# Altium schematic sheet Power.SchDoc
size A4; CompanyName: Technische Hochschule Nürnberg Georg Simon Ohm; Organization: UltraZohm; Address1: Kesslerplatz 12; Address2: 90489 Nürnberg; Address3: GERMANY; DocumentNumber: 2; SheetNumber: 2; SheetTotal: 6; Website: www.ultrazohm.com
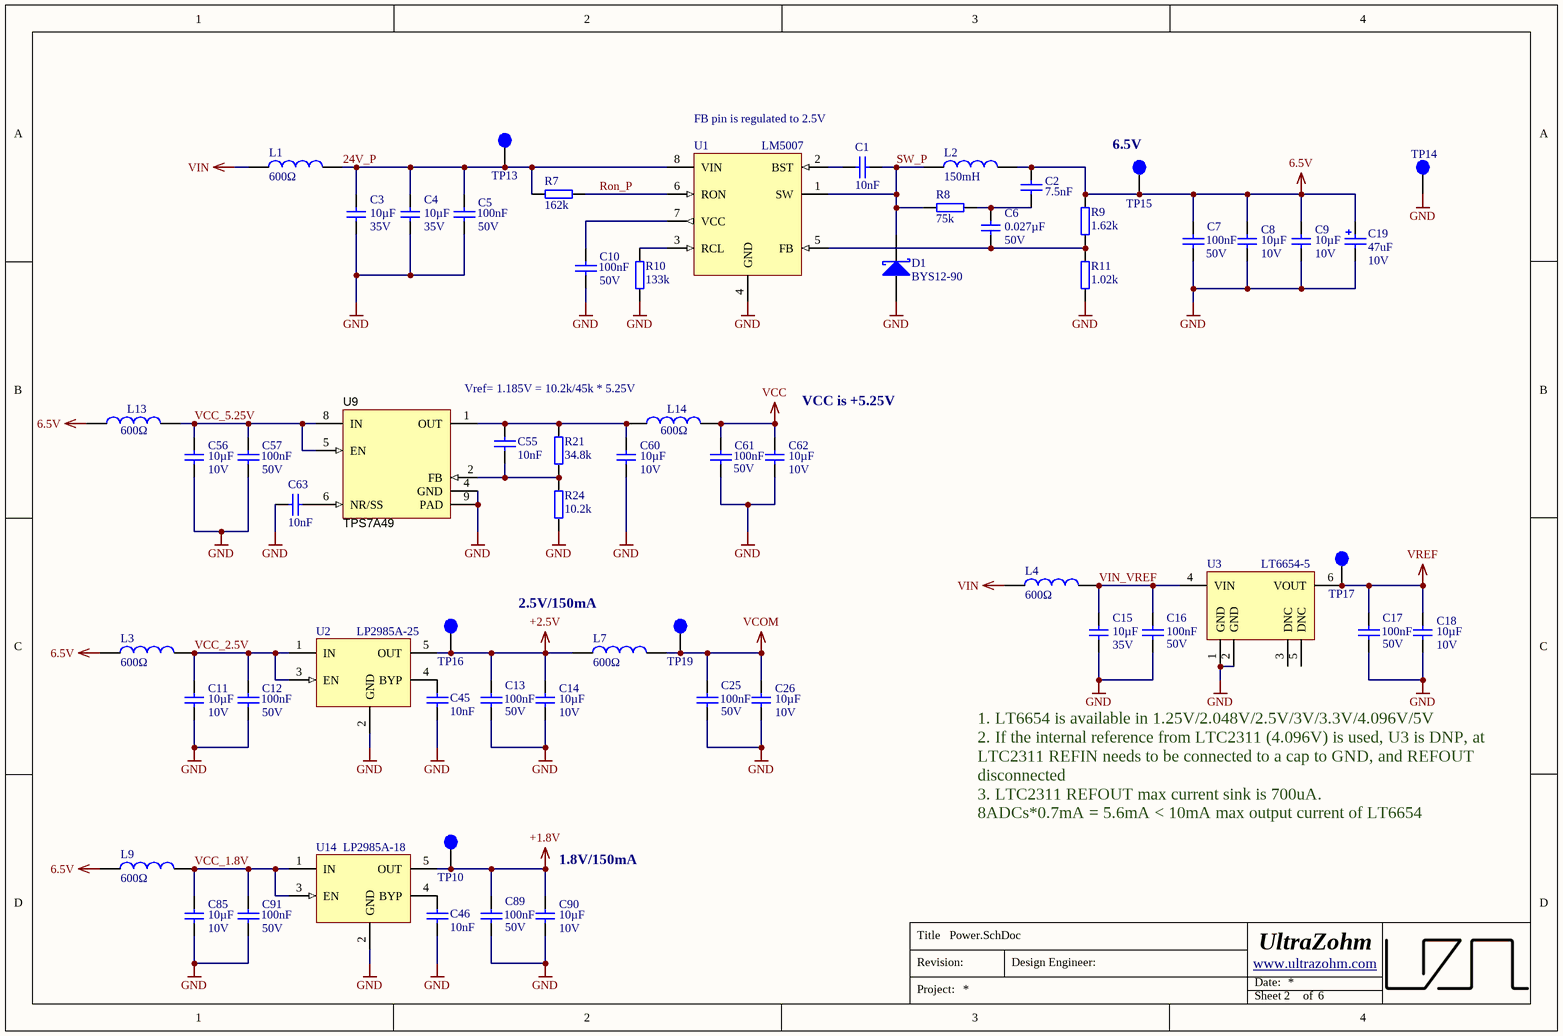
[diagram p0: Power.SchDoc]

## Parts
C1  10nF  [CAPC1608X07N]
C2  7.5nF  [CAPC1608X07N]
C3  10µF  Voltage: 35V  [C_1206]
C4  10µF  Voltage: 35V  [C_1206]
C5  100nF  Voltage: 50V  [CAPC1608X07N]
C6  0.027µF  Voltage: 50V  [C_1206]
C7  100nF  Voltage: 50V  [CAPC1608X07N]
C8  10µF  Voltage: 10V  [C_1206]
C9  10µF  Voltage: 10V  [C_1206]
C10  100nF  Voltage: 50V  [CAPC1608X07N]
C11  10µF  Voltage: 10V  [C_1206]
C12  100nF  Voltage: 50V  [CAPC1608X07N]
C13  100nF  Voltage: 50V  [CAPC1608X07N]
C14  10µF  Voltage: 10V  [C_1206]
C15  10µF  Voltage: 35V  [C_1206]
C16  100nF  Voltage: 50V  [CAPC1608X07N]
C17  100nF  Voltage: 50V  [CAPC1608X07N]
C18  10µF  Voltage: 10V  [C_1206]
C19  47uF  Voltage: 10V  [WCAP-ASLI_5x5.5]
C25  100nF  Voltage: 50V  [CAPC1608X07N]
C26  10µF  Voltage: 10V  [C_1206]
C45  10nF  [CAPC1608X07N]
C46  10nF  [CAPC1608X07N]
C55  10nF  [CAPC1608X07N]
C56  10µF  Voltage: 10V  [C_1206]
C57  100nF  Voltage: 50V  [CAPC1608X07N]
C60  10µF  Voltage: 10V  [C_1206]
C61  100nF  Voltage: 50V  [CAPC1608X07N]
C62  10µF  Voltage: 10V  [C_1206]
C63  10nF  [CAPC1608X07N]
C85  10µF  Voltage: 10V  [C_1206]
C89  100nF  Voltage: 50V  [CAPC1608X07N]
C90  10µF  Voltage: 10V  [C_1206]
C91  100nF  Voltage: 50V  [CAPC1608X07N]
D1  BYS12-90  [DIOM4227X23N]
L1  600Ω  [WE-CBF_0805_High Current]
L2  150mH  [SMT_inductor_1050_Performance]
L3  600Ω  [WE-CBF_0805_High Current]
L4  600Ω  [WE-CBF_0805_High Current]
L7  600Ω  [WE-CBF_0805_High Current]
L9  600Ω  [WE-CBF_0805_High Current]
L13  600Ω  [WE-CBF_0805_High Current]
L14  600Ω  [WE-CBF_0805_High Current]
R7  162k  [RESC1608X06N]
R8  75k  [RESC1608X06N]
R9  1.62k  [RESC1608X06N]
R10  133k  [RESC1608X06N]
R11  1.02k  [RESC1608X06N]
R21  34.8k  [RESC1608X06N]
R24  10.2k  [RESC1608X06N]
TP10  +1.8V  [TP_1mm]  (value not drawn)  (no BOM)
TP13  VIN  [TP_1mm]  (value not drawn)  (no BOM)
TP14  GND  [TP_1mm]  (value not drawn)  (no BOM)
TP15  +5V  [TP_1mm]  (value not drawn)  (no BOM)
TP16  OVCC  [TP_1mm]  (value not drawn)  (no BOM)
TP17  VREF  [TP_1mm]  (value not drawn)  (no BOM)
TP19  VCOM  [TP_1mm]  (value not drawn)  (no BOM)
U1  LM5007  [TSOP65P490X110-8N]
U2  LP2985A-25  [SOT95P250X110-5N]
U3  LT6654-5  [SOT95P280X100-6N]
U9  TPS7A49  [DGN0008D_N]
U14  LP2985A-18  [SOT95P250X110-5N]

## Nets
6.5V: C2.1 C7.2 C8.2 C9.2 C19.2(P) L2.2 L3.1 L9.1 L13.1 R9.2 TP15.1
+1.8V: C89.1 C90.2 TP10.1 U14.5(OUT)
+2.5V: C13.1 C14.2 L7.1 TP16.1 U2.5(OUT)
GND: C3.1 C4.1 C5.2 C7.1 C8.1 C9.1 C10.2 C11.1 C12.2 C13.2 C14.1 C15.1 C16.2 C17.2 C18.1 C19.1(N) C25.2 C26.1 C45.1 C46.1 C56.1 C57.2 C60.1 C61.1 C62.1 C63.2 C85.1 C89.2 C90.1 C91.2 D1.2(A) R10.1 R11.1 R24.2 TP14.1 U1.4(GND) U2.2(GND) U3.1(GND) U3.2(GND) U9.4(GND) U9.9(PAD) U14.2(GND)
VCC: C61.2 C62.2 L14.2
VCOM: C25.1 C26.2 L7.2 TP19.1
VIN: L1.1 L4.1
VREF: C17.1 C18.2 TP17.1 U3.6(VOUT)
24V_P: C3.2 C4.2 C5.1 L1.2 R7.1 TP13.1 U1.8(VIN)
Ron_P: R7.2 U1.6(RON)
SW_P: C1.2 D1.1(K) L2.1 R8.1 U1.1(SW)
VCC_1.8V: C85.2 C91.1 L9.2 U14.1(IN) U14.3(EN)
VCC_2.5V: C11.2 C12.1 L3.2 U2.1(IN) U2.3(EN)
VCC_5.25V: C56.2 C57.1 L13.2 U9.5(EN) U9.8(IN)
VIN_VREF: C15.2 C16.1 L4.2 U3.4(VIN)
NetC1_1: C1.1 U1.2(BST)
NetC2_2: C2.2 C6.2 R8.2
NetC6_1: C6.1 R9.1 R11.2 U1.5(FB)
NetC10_1: C10.1 U1.7(VCC)
NetC45_2: C45.2 U2.4(BYP)
NetC46_2: C46.2 U14.4(BYP)
NetC55_1: C55.1 C60.2 L14.1 R21.1 U9.1(OUT)
NetC55_2: C55.2 R21.2 R24.1 U9.2(FB)
NetC63_1: C63.1 U9.6(NR/SS)
NetR10_2: R10.2 U1.3(RCL)

Not connected (* = marked no-connect by the designer): U3 3(DNC) 5(DNC); U9 3(NC) 7(DNC)

## Notes on the sheet
- FB pin is regulated to 2.5V
- (near TP15) 6.5V
- Vref= 1.185V = 10.2k/45k * 5.25V
- (near C62) VCC is +5.25V
- (near L7) 2.5V/150mA
- 1. LT6654 is available in 1.25V/2.048V/2.5V/3V/3.3V/4.096V/5V
  2. If the internal reference from LTC2311 (4.096V) is used, U3 is DNP, at LTC2311 REFIN needs to be connected to a cap to GND, and REFOUT disconnected
  3. LTC2311 REFOUT max current sink is 700uA.
  8ADCs*0.7mA = 5.6mA < 10mA max output current of LT6654
- (near C90) 1.8V/150mA
- Title
- Revision:
- Design Engineer:
- Date:
- Project:
- Sheet
- of

## Library data of the parts
C1 C45 C46 = Cap_0603: MPN: 885012206065; MF: Würth; Voltage: 25V; Dielectric: X7R; Value: 10nF; Supplier 1: Mouser; Supplier 2: *; Supplier Part Number 1: 710-885012206065; Supplier Part Number 2: *; Package: 0603
C2 = Cap_0603: MPN: C0603C752J3GACTU; MF: KEMET; Voltage: 25V; Dielectric: C0G; Value: 7.5nF; Supplier 1: Mouser; Supplier 2: *; Supplier Part Number 1: 80-C0603C752J3GACTU; Supplier Part Number 2: *; Package: 0603
C3 C4 C15 = C_1206: Capacitor 1206; MPN: 1206DD106MAT2A; Tolerance: 20%; MF: AVX; Dielectric: X5R; Package: 1206; Value: 10µF; Supplier 1: Mouser; Supplier Part Number 1: 581-1206DD106MAT2A
C5 C10 C12 C57 C61 C91 = Cap_0603: MPN: CC0603KRX7R9BB104; MF: Yageo; Tolerance: 10%; Dielectric: X5R; Value: 100nF; Supplier 1: Mouser; Supplier 2: Mouser; Supplier Part Number 1: 603-CC603KRX7R9BB104; Supplier Part Number 2: 710-885382206004; Package: 0603
C6 = C_1206: Capacitor 1206; MPN: GRM3195C1H273JA01D; Tolerance: 5%; MF: Murata; Dielectric: C0G; Package: 1206; Value: 0.027µF; Created: 2018_06_25_AGeiger; Supplier 1: Mouser; Supplier Part Number 1: 81-GRM315C1H273JA01D
C7 C13 C16 C17 C25 C89 = Cap_0603: MPN: CC0603KRX7R9BB104; MF: Yageo; Dielectric: X5R; Value: 100nF; Supplier 1: Mouser; Supplier 2: Mouser; Supplier Part Number 1: 603-CC603KRX7R9BB104; Supplier Part Number 2: 710-885382206004; Package: 0603
C8 C9 C11 C14 C18 C26 C56 C60 C62 C85 C90 = C_1206: Capacitor 1206; MPN: CL31A106KPHNNNE; Tolerance: 10%; MF: Samsung Electro-Mechanics; Dielectric: X5R; Package: 1206; Value: 10µF; Created: 2020_09_17_Liegmann; Supplier 1: Mouser; Supplier Part Number 1: 187-CL31A106KPHNNNE
C19 = 865080142007: WCAP-ASLI Aluminum Electrolytic Capacitor, V-Chip, SMT, D5xH5.5mm, 47uF, 10V; MPN: 865080242004; Dissipation Factor: 24%; Endurance: 2000h; Leakage Current: 6.3uA; MF: Wurth Elektronik; Ripple Current: 170mA; Capacitance Tolerance: +/-20%; Technical Reference: ASEC055101M6R3DVCTBB000; ComponentLink1Description: Manufacturer; ComponentLink1URL: http://www.we-online.de; ComponentLink2Description: Datasheet; ComponentLink2URL: https://www.we-online.com/catalog/datasheet/865080142007.pdf; Height: 5.5mm; Mounting Technology: SMT; Operating Temperature: -55 to +105degC; Packaging: Tape and Reel; Published Date: May 2020; Diameter: 5mm; Supplier 1: Mouser; Supplier Part Number 1: 710-865080242004; Value: 47uF
C55 C63 = Cap_0603: MPN: 885012206065; MF: Würth Elektronik; Voltage: 25V; Dielectric: X7R; Value: 10nF; Supplier 1: Mouser; Supplier 2: Digi-Key; Supplier Part Number 1: 710-885012206065; Supplier Part Number 2: 732-7983-1-ND; Package: 0603
D1 = BYS12-90: Schottky Diode; MPN: BYS12-90-E3/TR3; MF: Vishay; Forward Voltage: 750mV; Reverse Voltage: 90V; Rated Current: 1.5A; Package: DO-214AC; Supplier 1: Farnell; Supplier 2: Mouser; Supplier 3: Digi-Key; Supplier Part Number 1: 2889144; Supplier Part Number 2: 625-BYS12-90-E3/TR3; Supplier Part Number 3: BYS12-90-E3/GICT-ND; ComponentLink1Description: Manufacturer; ComponentLink1URL: https://www.vishay.com/; ComponentLink2Description: Datasheet; ComponentLink2URL: https://www.vishay.com/docs/88950/bys12-90.pdf
L1 L3 L4 L7 L9 = WE-CBF, 742792040: WE-CBF SMD EMI Suppression Ferrite Bead, 0805, 600Ω; MF: Wurth Elektronik; Type: High Current; PublishedDate: Aug 2016; ComponentLink1Description: Manufacturer; ComponentLink1URL: http://www.we-online.de; ComponentLink2Description: Datasheet; ComponentLink2URL: http://katalog.we-online.de/pbs/datasheet/742792040.pdf; MPN: 742792040; Value: 600Ω; Size: 0805; Supplier 1: Farnell; Supplier 2: Mouser; Supplier 3: Digi-Key; Supplier Part Number 1: 2761567; Supplier Part Number 2: 710-742792040; Supplier Part Number 3: 732-1620-1-ND
L2 = B82464G4154M: SMT power Inductor, 150uH, 320m DRC; MF: EPCOS / TDK; Rated Current: 0.85 A; MPN: B82464G4154M; Supplier 1: Mouser; Supplier Part Number 1: 871-B82464G4154M; Value: 150mH; DCR: 320m; ComponentLink1Description: Manufacturer; ComponentLink1URL: https://www.tdk-electronics.tdk.com/de; ComponentLink2Description: Datasheet; ComponentLink2URL: https://www.tdk-electronics.tdk.com/inf/30/db/ind_2008/b82464g4.pdf
L13 L14 = WE-CBF, 742792040: WE-CBF SMD EMI Suppression Ferrite Bead, 0805, 600Ω; MF: Würth Elektronik; Type: High Current; ComponentLink1Description: Manufacturer; ComponentLink1URL: http://www.we-online.de; ComponentLink2Description: Datasheet; ComponentLink2URL: http://katalog.we-online.de/pbs/datasheet/742792040.pdf; MPN: 742792040; Value: 600Ω; Size: 0805; Supplier 1: Farnell; Supplier 2: Mouser; Supplier 3: Digi-Key; Supplier Part Number 1: 1635735; Supplier Part Number 2: 710-742792040; Supplier Part Number 3: 732-1620-1-ND
R7 = R_0603: MPN: CR0603-FX-1623ELF; MF: Bourns; Value: 162k; Supplier 1: Mouser; Supplier Part Number 1: 652-CR0603-FX1623ELF; Package: 0603
R8 = R_0603: MPN: AC0603FR-1375KL; MF: Yageo; Value: 75k; Supplier 1: Mouser; Supplier Part Number 1: 603-AC0603FR-1375KL; Package: 0603
R9 = R_0603: MPN: CR0603-FX-1621ELF; MF: Bourns; Tolerance: 1%; Value: 1.62k; Supplier 1: Mouser; Supplier Part Number 1: 652-CR0603FX-1621ELF; Package: 0603
R10 = R_0603: MPN: CR0603-FX-1333ELF; MF: Bourns; Value: 133k; Supplier 1: Mouser; Supplier Part Number 1: 652-CR0603FX-1333ELF; Package: 0603
R11 = R_0603: MPN: CR0603-FX-1021ELF; MF: Bourns; Tolerance: 1%; Value: 1.02k; Supplier 1: Mouser; Supplier Part Number 1: 652-CR0603FX-1021ELF; Package: 0603
R21 = R_0603: MPN: CR0603-FX-3482ELF; MF: Bourns; Tolerance: 1%; Value: 34.8k; Supplier 1: Mouser; Supplier Part Number 1: 652-CR0603FX-3482ELF; Package: 0603
R24 = R_0603: MPN: CR0603-FX-1022ELF; MF: Bourns; Tolerance: 1%; Value: 10.2k; Supplier 1: Mouser; Supplier Part Number 1: 652-CR0603FX-1022ELF; Package: 0603
TP10 TP13-TP17 TP19 = TP_1mm: Testpoint 1mm; Created: 2018_06_25_AGeiger; Value: Testpoint 1mm
U1 = LM5007: Buck Converter, 9-75Vin, 2.5-73Vout; MPN: LM5007MM/NOPB; MF: Texas Instruments; Supplier 1: Farnell; Supplier 2: Mouser; Supplier 3: Digi-Key; Supplier Part Number 1: 9779345; Supplier Part Number 2: 926-LM5007MM/NOPB; Supplier Part Number 3: LM5007MM/NOPBCT-ND; Package: VSSOP-8; ComponentLink1Description: Manufacturer; ComponentLink1URL: https://www.ti.com/; ComponentLink2Description: Datasheet; ComponentLink2URL: https://www.ti.com/lit/ds/symlink/lm5007.pdf?ts=1616234834930&ref_url=https%253A%252F%252Fwww.google.ru%252F
U2 = LP2985A-25: 150mA, LDO, Vout = 2.5V, Vin,max = 16V; MF: Texas Instruments; MPN: LP2985A-25; Supplier 1: Mouser; Supplier Part Number 1: 595-LP2985A-25DBVR; Package: SOT-23-5; ComponentLink1Description: Manufacturer; ComponentLink1URL: https://www.ti.com/; ComponentLink2Description: Datasheet; ComponentLink2URL: https://www.ti.com/lit/ds/symlink/lp2985a.pdf
U3 = LT6654: MPN: LT6654AIS6-5#TRMPBF; MF: Analog Devices; Package: TSOT-23-6; Supplier 1: Farnell; Supplier 2: Mouser; Supplier 3: Digi-Key; Supplier Part Number 1: 2761960; Supplier Part Number 2: 584-6654AIS65TRMPBF; Supplier Part Number 3: LT6654AIS6-5#TRMPBFCT-ND; ComponentLink1Description: Manufacturer; ComponentLink1URL: https://www.analog.com/en/index.html; ComponentLink2Description: Datasheet; ComponentLink2URL: https://www.analog.com/media/en/technical-documentation/data-sheets/6654fh.pdf
U9 = TPS7A4901DGN: +36V, +150mA, Ultralow-Noise, Positive LINEAR REGULATOR, DGN0008D; CompType: IC; MF: Texas Instruments; MPN: TPS7A4901DGN; PackageReference: DGN0008D; MountType: SMT; ComponentLink1Description: Datasheet Link; ComponentLink1URL: http://www.ti.com/lit/ds/symlink/tps7a4901.pdf; Supplier 1: Digi-Key; Supplier Part Number 1: 296-27751-6-ND; Supplier 2: Mouser; Supplier Part Number 2: 595-TPS7A4901DGNR; Supplier 3: Fanell; Supplier Part Number 3: 3008004
U14 = LP2985A-18: 150mA, LDO, Vout = 1.8V , Vin,max = 16V; Manufacturer 1: Texas Instruments; Supplier 1: Mouser; Supplier Part Number 1: 595-LP2985A-18DBVJ; Package: SOT-23-5; ComponentLink1Description: Manufacturer; ComponentLink1URL: https://www.ti.com/; ComponentLink2Description: Datasheet; ComponentLink2URL: https://www.ti.com/lit/ds/symlink/lp2985a.pdf; Manufacturer Part Number 1: LP2985A-18